# Altium project Compact Inverter DC Link.PrjPcb
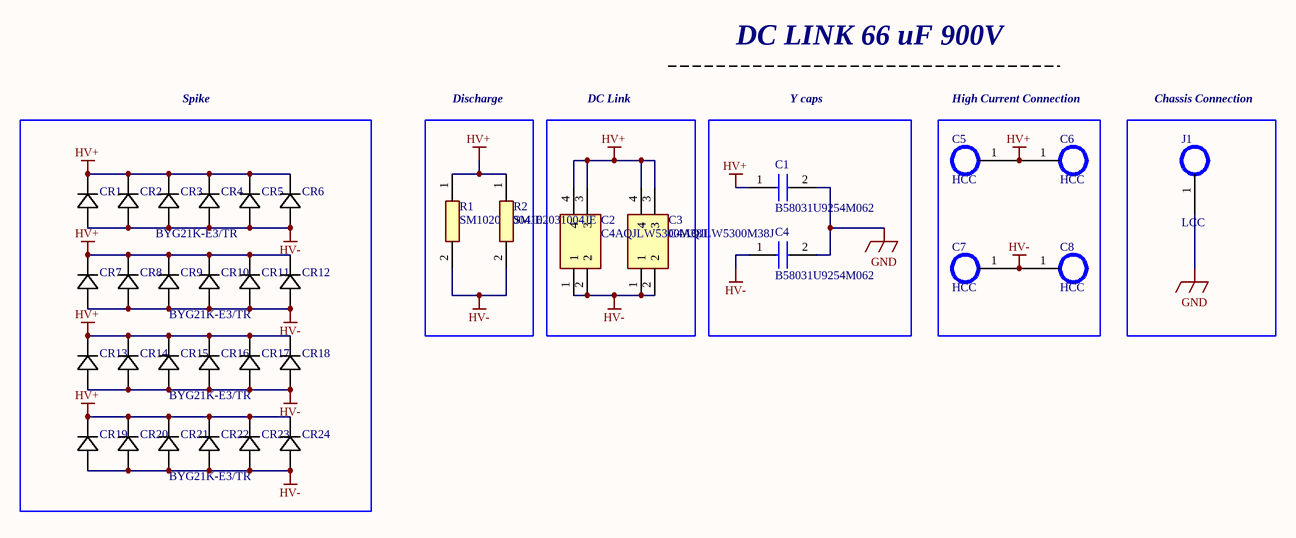
[diagram p0: Schematic.SchDoc]
Model: 24
1 sheet, 35 parts. Net scope: global (net labels, ports and power ports of the same name join across sheets).
Board file: PCB.PcbDoc

## Sheet Schematic.SchDoc
size A4; Author: LIONG MA; Revision: 2; SheetNumber: 1; SheetTotal: 2

### Parts
C1  B58031U9254M062  [B58031U9254M062]
C2  C4AQJLW5300M38J  [C4AQJLW5300M38J]
C3  C4AQJLW5300M38J  [C4AQJLW5300M38J]
C4  B58031U9254M062  [B58031U9254M062]
C5  HCC  [6mm Pad]
C6  HCC  [6mm Pad]
C7  HCC  [6mm Pad]
C8  HCC  [6mm Pad]
CR1  BYG21K-E3/TR  [DO-214AC_VIS]
CR2  BYG21K-E3/TR  [DO-214AC_VIS]  (value not drawn)
CR3  BYG21K-E3/TR  [DO-214AC_VIS]  (value not drawn)
CR4  BYG21K-E3/TR  [DO-214AC_VIS]  (value not drawn)
CR5  BYG21K-E3/TR  [DO-214AC_VIS]  (value not drawn)
CR6  BYG21K-E3/TR  [DO-214AC_VIS]  (value not drawn)
CR7  BYG21K-E3/TR  [DO-214AC_VIS]
CR8  BYG21K-E3/TR  [DO-214AC_VIS]  (value not drawn)
CR9  BYG21K-E3/TR  [DO-214AC_VIS]  (value not drawn)
CR10  BYG21K-E3/TR  [DO-214AC_VIS]  (value not drawn)
CR11  BYG21K-E3/TR  [DO-214AC_VIS]  (value not drawn)
CR12  BYG21K-E3/TR  [DO-214AC_VIS]  (value not drawn)
CR13  BYG21K-E3/TR  [DO-214AC_VIS]
CR14  BYG21K-E3/TR  [DO-214AC_VIS]  (value not drawn)
CR15  BYG21K-E3/TR  [DO-214AC_VIS]  (value not drawn)
CR16  BYG21K-E3/TR  [DO-214AC_VIS]  (value not drawn)
CR17  BYG21K-E3/TR  [DO-214AC_VIS]  (value not drawn)
CR18  BYG21K-E3/TR  [DO-214AC_VIS]  (value not drawn)
CR19  BYG21K-E3/TR  [DO-214AC_VIS]
CR20  BYG21K-E3/TR  [DO-214AC_VIS]  (value not drawn)
CR21  BYG21K-E3/TR  [DO-214AC_VIS]  (value not drawn)
CR22  BYG21K-E3/TR  [DO-214AC_VIS]  (value not drawn)
CR23  BYG21K-E3/TR  [DO-214AC_VIS]  (value not drawn)
CR24  BYG21K-E3/TR  [DO-214AC_VIS]  (value not drawn)
J1  LCC  [PAD 3MM]
R1  SM102031004JE  [SM102031004JE]
R2  SM102031004JE  [SM102031004JE]

### Blocks framed on the sheet
Spike: CR1-CR24
Discharge: R1 R2
DC Link: C2 C3
Y caps: C1 C4
High Current Connection: C5-C8
Chassis Connection: J1

### Nets
GND: C1.2 C4.2 J1.1
HV+: C1.1 C2.3 C2.4 C3.3 C3.4 C5.1 C6.1 CR1.1 CR2.1 CR3.1 CR4.1 CR5.1 CR6.1 CR7.1 CR8.1 CR9.1 CR10.1 CR11.1 CR12.1 CR13.1 CR14.1 CR15.1 CR16.1 CR17.1 CR18.1 CR19.1 CR20.1 CR21.1 CR22.1 CR23.1 CR24.1 R1.1 R2.1
HV-: C2.1 C2.2 C3.1 C3.2 C4.1 C7.1 C8.1 CR1.2 CR2.2 CR3.2 CR4.2 CR5.2 CR6.2 CR7.2 CR8.2 CR9.2 CR10.2 CR11.2 CR12.2 CR13.2 CR14.2 CR15.2 CR16.2 CR17.2 CR18.2 CR19.2 CR20.2 CR21.2 CR22.2 CR23.2 CR24.2 R1.2 R2.2

### Notes on the sheet
- DC LINK 66 uF 900V
- MY
- 25
- Project:
- Author
- Revision
- Sheet
- Modified
- of

### Library data of the parts
C1 C4 = B58031U9254M062: Capacitor; Manufacturer_Name: TDK; Datasheet Link: https://product.tdk.com/system/files/dam/doc/product/capacitor/ceramic/ceralink/data_sheet/20/10/ds/b58031_lp.pdf; Height: 4.5mm; Manufacturer_Part_Number: B58031U9254M062; Mouser Part Number: 871-B58031U9254M062; Mouser Price/Stock: https://www.mouser.co.uk/ProductDetail/EPCOS-TDK/B58031U9254M062?qs=Mv7BduZupUir5egwM6Ifng%3D%3D; Arrow Part Number: B58031U9254M062; Arrow Price/Stock: https://www.arrow.com/en/products/b58031u9254m062/tdk?region=europe
C2 C3 = C4AQJLW5300M38J: Capacitor; Manufacturer_Name: KEMET; Datasheet Link: https://content.kemet.com/datasheets/KEM_F3125_C4AQ_M.pdf; Height: 25.2mm; Manufacturer_Part_Number: C4AQJLW5300M38J; Mouser Part Number: 80-C4AQJLW5300M38J; Mouser Price/Stock: https://www.mouser.co.uk/ProductDetail/KEMET/C4AQJLW5300M38J?qs=81r%252BiQLm7BQPDIKgnvCGAA%3D%3D
CR1-CR24 = BYG21K-E3TR: 1.5A,800V,120nS FS AVALANCHE SMD; Manufacturer_Name: Vishay; Copyright: Copyright (C) 2025 Ultra Librarian. All rights reserved.; Manufacturer_Part_Number: BYG21K-E3/TR; Datasheet: https://www.vishay.com/doc?88961
R1 R2 = SM102031004JE: Resistor; Manufacturer_Name: Ohmite; Datasheet Link: https://www.ohmite.com/assets/docs/res_slimmox.pdf?r=false; Height: 8.64mm; Manufacturer_Part_Number: SM102031004JE